# Altium schematic sheet Controller.SchDoc: Controller
size A4; SheetNumber: 3; SheetTotal: 8
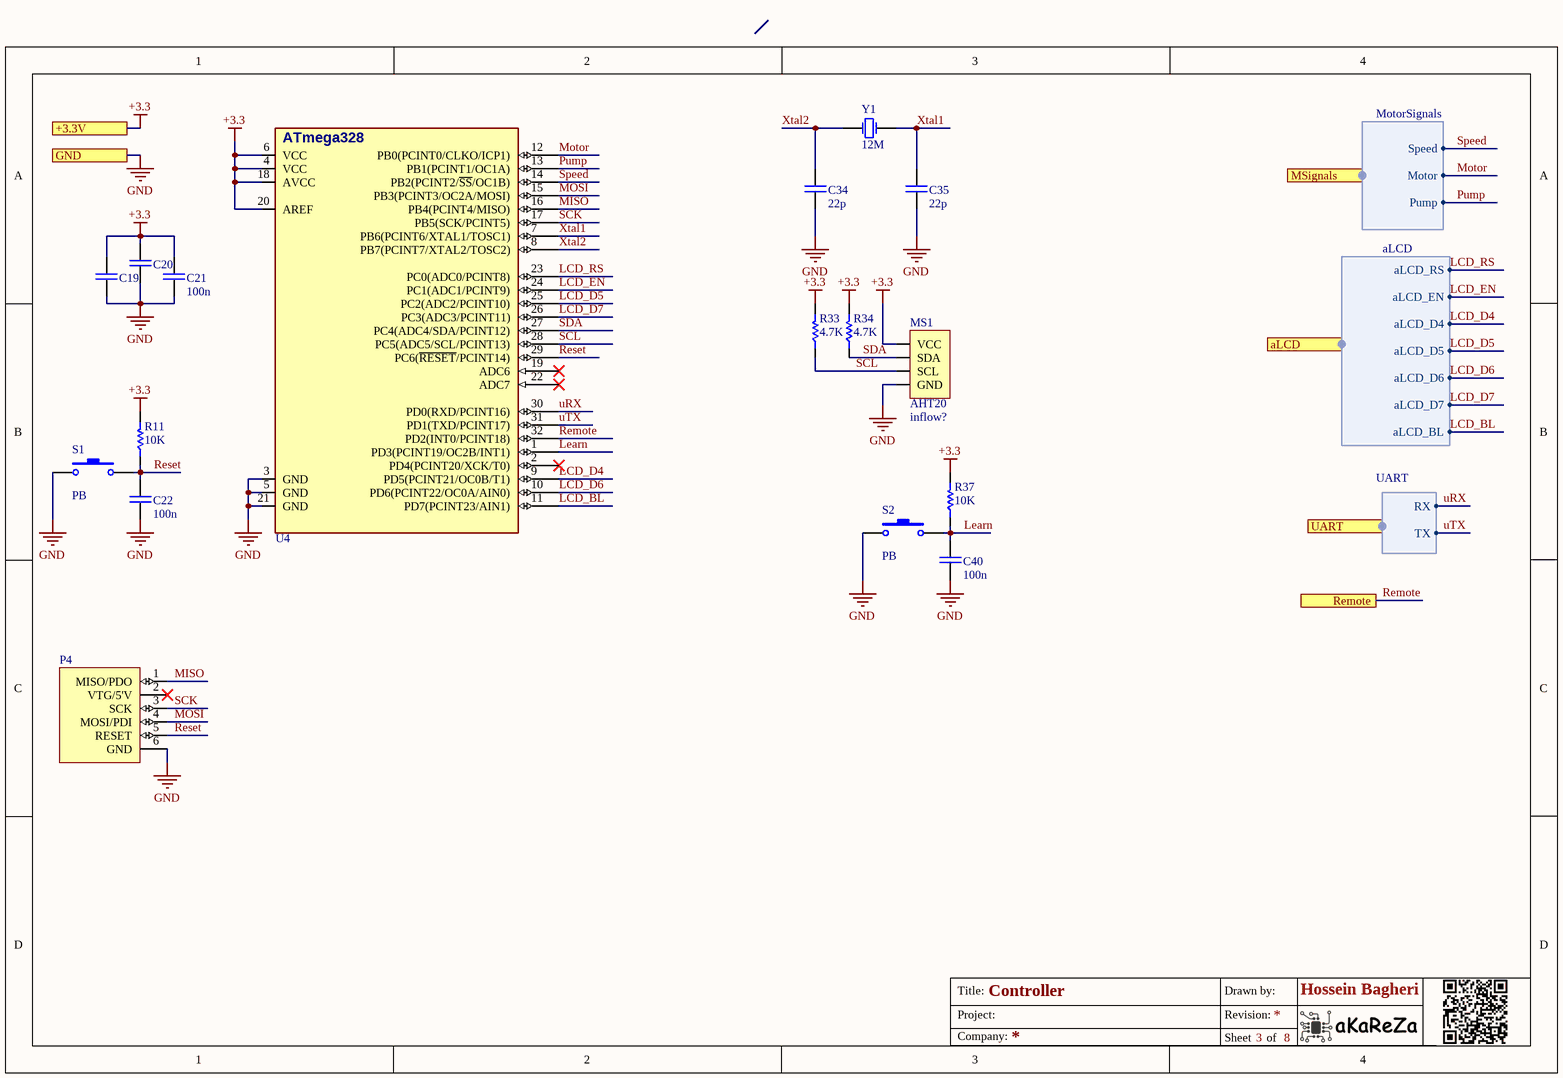
[diagram p0: Controller.SchDoc]

## Parts
C19  100n  [CAP 0805/2012]  (value not drawn)
C20  100n  [CAP 0805/2012]  (value not drawn)
C21  100n  [CAP 0805/2012]
C22  100n  [CAP 0805/2012]
C34  22p  [CAP 0805/2012]
C35  22p  [CAP 0805/2012]
C40  100n  [CAP 0805/2012]
MS1  Inflow: inflow?  [AHT20]  (hidden comment: AHT20)
P4  3x2  [IDC_2X3]  (value not drawn)
R11  10K  [RES 0805 (2012X06L)]
R33  4.7K  [RES 0805 (2012X06L)]
R34  4.7K  [RES 0805 (2012X06L)]
R37  10K  [RES 0805 (2012X06L)]
S1  PB  [SW_PB_SMD_2PIN_SPST_6X3X2]
S2  PB  [SW_PB_SMD_2PIN_SPST_6X3X2]
U4  ATmega328P  [ATMEGA328]  (value not drawn)
Y1  12M  [Crystal SMD]

## Ports
+3.3V, aLCD (harness aLCD), GND, MSignals (harness MotorSignals), Remote, UART (harness UART)

## Harnesses
MotorSignals: Speed, Motor, Pump
UART: RX, TX
aLCD: aLCD_RS, aLCD_EN, aLCD_D4, aLCD_D5, aLCD_D6, aLCD_D7, aLCD_BL

## Nets
+3.3: C19.1 C20.1 C21.1 MS1.4(VCC) R11.2 R33.2 R34.2 R37.2 U4.4(VCC) U4.6(VCC) U4.18(AVCC) U4.20(AREF) ; port +3.3V
GND: C19.2 C20.2 C21.2 C22.2 C34.2 C35.2 C40.2 MS1.3(GND) P4.6(GND) S1.1 S2.1 U4.3(GND) U4.5(GND) U4.21(GND) ; port GND
LCD_BL: U4.11(PD7(PCINT23/AIN1)) ; port aLCD.aLCD_BL
LCD_D4: U4.9(PD5(PCINT21/OC0B/T1)) ; port aLCD.aLCD_D4
LCD_D5: U4.25(PC2(ADC2/PCINT10)) ; port aLCD.aLCD_D5
LCD_D6: U4.10(PD6(PCINT22/OC0A/AIN0)) ; port aLCD.aLCD_D6
LCD_D7: U4.26(PC3(ADC3/PCINT11)) ; port aLCD.aLCD_D7
LCD_EN: U4.24(PC1(ADC1/PCINT9)) ; port aLCD.aLCD_EN
LCD_RS: U4.23(PC0(ADC0/PCINT8)) ; port aLCD.aLCD_RS
Learn: C40.1 R37.1 S2.2 U4.1(PD3(PCINT19/OC2B/INT1))
MISO: P4.1(MISO/PDO) U4.16(PB4(PCINT4/MISO))
MOSI: P4.4(MOSI/PDI) U4.15(PB3(PCINT3/OC2A/MOSI))
Motor: U4.12(PB0(PCINT0/CLKO/ICP1)) ; port MSignals.Motor
Pump: U4.13(PB1(PCINT1/OC1A)) ; port MSignals.Pump
Remote: U4.32(PD2(INT0/PCINT18)) ; port Remote
Reset: C22.1 P4.5(RESET) R11.1 S1.2 U4.29(PC6(~{RESET}/PCINT14))
SCK: P4.3(SCK) U4.17(PB5(SCK/PCINT5))
SCL: MS1.2(SCL) R33.1 U4.28(PC5(ADC5/SCL/PCINT13))
SDA: MS1.1(SDA) R34.1 U4.27(PC4(ADC4/SDA/PCINT12))
Speed: U4.14(PB2(PCINT2/~{SS}/OC1B)) ; port MSignals.Speed
uRX: U4.30(PD0(RXD/PCINT16)) ; port UART.RX
uTX: U4.31(PD1(TXD/PCINT17)) ; port UART.TX
Xtal1: C35.1 U4.7(PB6(PCINT6/XTAL1/TOSC1)) Y1.2(OSC2)
Xtal2: C34.1 U4.8(PB7(PCINT7/XTAL2/TOSC2)) Y1.1(OSC1)

Not connected (* = marked no-connect by the designer): P4 2(VTG/5'V)*; U4 2(PD4(PCINT20/XCK/T0))* 19(ADC6)* 22(ADC7)*

## Notes on the sheet
- Title:
- Project:
- Drawn by:
- Revision:
- Hossein Bagheri
- Company:
- Sheet
- of
- (in symbol IC_MCU_ATmega328P_SMD) ATmega328

## Library data of the parts
C19-C22 C40 = Cap_Multi_SMD_100nF_0805: Bipolar ceramic capacitor SMD; Inflow: inflow?; Type: MultiLayer; Rating: 50V; Validation: Valid; Package: 0805; Value: 100n
C34 C35 = Cap_Multi_SMD_0805: Bipolar ceramic capacitor SMD; Inflow: inflow?; Type: MultiLayer; Rating: Rating?; Validation: Valid; Package: 0805; Value: 22p
MS1 = ModSen_AHT20: Air Temperature and Humidity Sensor; Rating: Rating?; Validation: NT; Package: Dip; Type: Air T&H; Value: AHT20
P4 = Con_Prog_MKII_ISP: 6 Pin Standard ISP Header For MKII; Rating: Rating?; Validation: NT; Inflow: inflow?; Value: 3x2; Package: Package?; Type: Type?
R11 R33 R34 R37 = Res_SMD_0805: Resistor; Inflow: inflow?; Rating: 0.125W; Validation: Valid; Package: 0805; Type: 10%
  R11 R37: Value: 10K
  R33 R34: Value: 4.7K
S1 S2 = SW_PushButton_2_SMD: SMT Tactile ‎Switch; Rating: 2b; Validation: Valid; Inflow: 8260; Type: Vertical; Package: SMD; Value: PB
U4 = IC_MCU_ATmega328P_SMD: 8-Bit AVR Microcontroller with 32K Bytes of In-System Programmable Flash Memory; Rating: Rating?; Validation: Valid; Inflow: inflow?; Value: ATmega328P; Package: Package?; Type: Type?
Y1 = Other_Elec_Xtal_SMD: Crystal Oscillator; Rating: Rating?; Inflow: inflow?; Validation: Valid; Package: SMD; Type: Quartz; Value: 12M